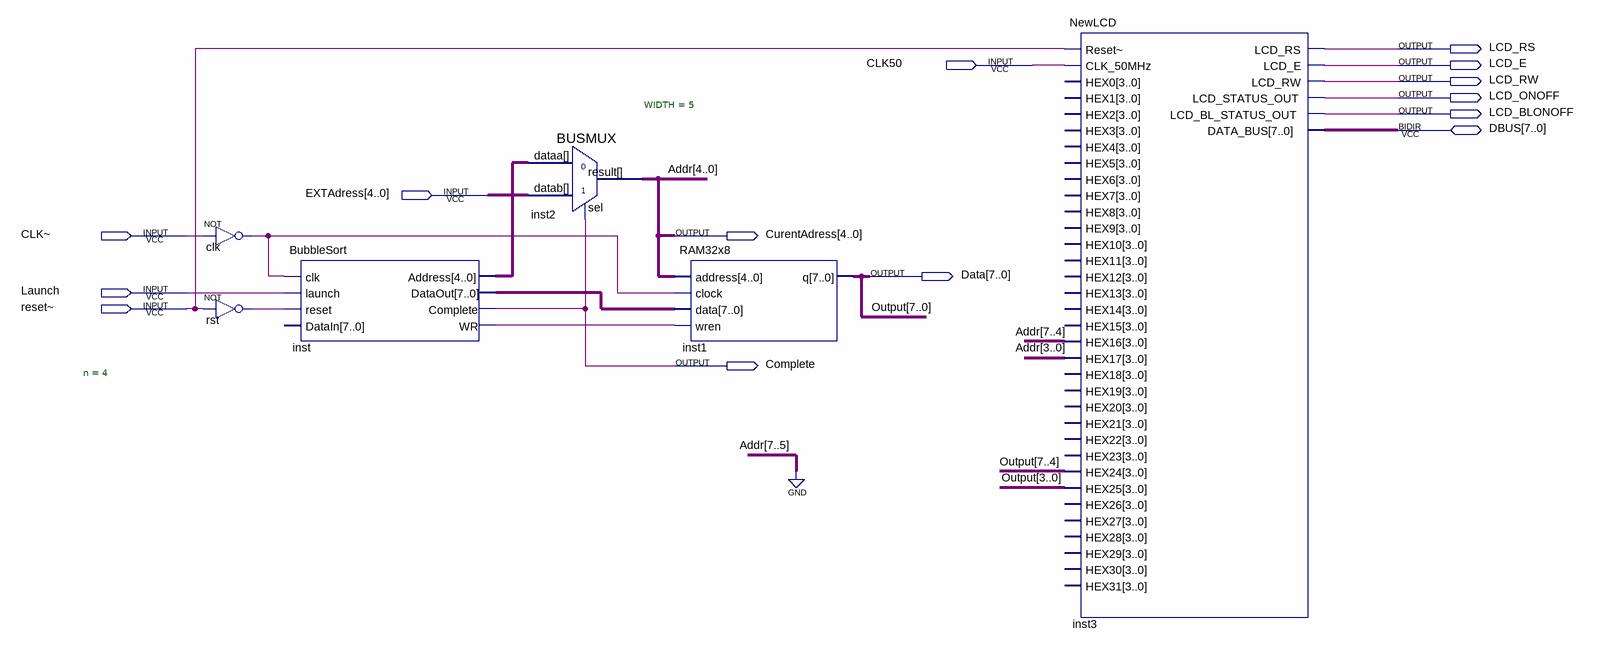
[diagram p0: schematic sheet]
// Quartus schematic Sorterbdf.bdf as structural Verilog: 6 symbols, 14 pins
module Sorterbdf (
  input  CLK50,
  input  [4:0] EXTAdress,
  input  \CLK~ ,
  input  Launch,
  input  \reset~ ,
  inout  [7:0] DBUS,
  output LCD_RS,
  output LCD_E,
  output LCD_RW,
  output LCD_ONOFF,
  output LCD_BLONOFF,
  output [4:0] CurentAdress,
  output [7:0] Data,
  output Complete
);

  wire clk_out, inst_wr, rst_out;
  wire [4:0] inst_address;
  wire [7:0] inst_dataout;

  not clk (clk_out, \CLK~ );
  not rst (rst_out, \reset~ );
  BubbleSort #(.n(4)) inst (
    .clk(clk_out), .launch(Launch), .reset(rst_out), .Address(inst_address), .DataOut(inst_dataout),
    .Complete(Complete), .WR(inst_wr));  // open: DataIn
  BUSMUX #(.WIDTH(5)) inst2 (.datab(EXTAdress), .sel(Complete), .dataa(inst_address), .result(CurentAdress));
  RAM32x8 inst1 (.address(CurentAdress), .clock(clk_out), .data(inst_dataout), .wren(inst_wr), .q(Data));
  NewLCD inst3 (
    .\Reset~ (\reset~ ), .CLK_50MHz(CLK50), .HEX16({3'b000, CurentAdress[4]}), .HEX17(CurentAdress[3:0]),
    .HEX24(Data[7:4]), .HEX25(Data[3:0]), .LCD_RS(LCD_RS), .LCD_E(LCD_E), .LCD_RW(LCD_RW),
    .LCD_STATUS_OUT(LCD_ONOFF), .LCD_BL_STATUS_OUT(LCD_BLONOFF), .DATA_BUS(DBUS));  // open: HEX0, HEX1, HEX2, HEX3, HEX4, HEX5, HEX6, HEX7, HEX8, HEX9, HEX10, HEX11, HEX12, HEX13, HEX14, HEX15, HEX18, HEX19, HEX20, HEX21, HEX22, HEX23, HEX26, HEX27, HEX28, HEX29, HEX30, HEX31

  // Other names for the same wires on the sheet: Addr[4:0] = CurentAdress; Output[7:0] = Data
endmodule
